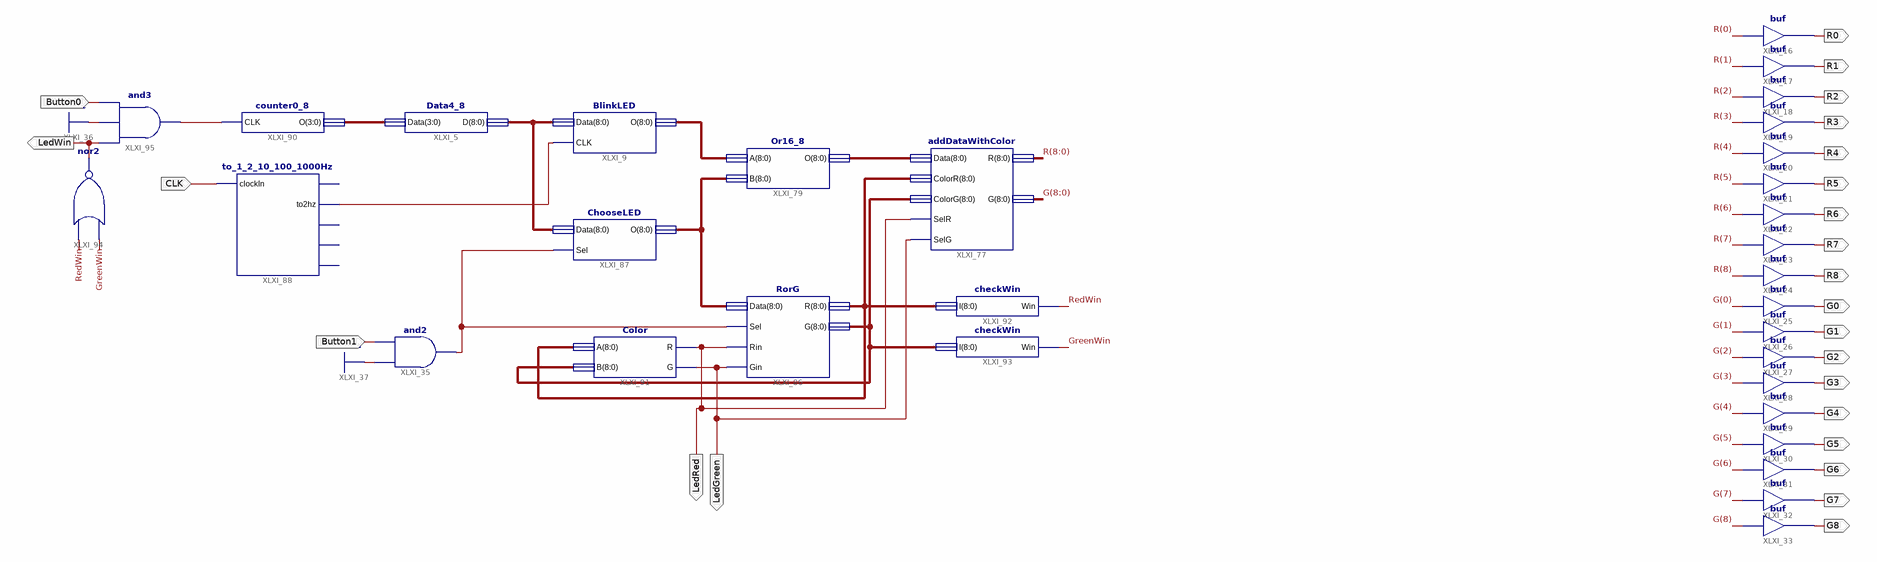
[diagram p0: schematic sheet 1]
// Xilinx ISE schematic Main.sch (spartan6) as structural Verilog: 32 symbols, 24 ports
module Main (
  input  CLK,
  input  Button1,
  input  Button0,
  output R0,
  output R1,
  output R2,
  output R3,
  output R4,
  output R5,
  output R6,
  output R7,
  output R8,
  output G0,
  output G1,
  output G2,
  output G3,
  output G4,
  output G5,
  output G6,
  output G7,
  output G8,
  output LedRed,
  output LedGreen,
  output LedWin
);

  wire GreenWin, RedWin, XLXN_13, XLXN_74, XLXN_189;
  wire [3:0] XLXN_9;
  wire [8:0] G, R, XLXN_147, XLXN_148, XLXN_162, XLXN_164, XLXN_186, XLXN_190;

  Data4_8 XLXI_5 (.Data(XLXN_9), .D(XLXN_190));
  BlinkLED XLXI_9 (.Data(XLXN_190), .CLK(XLXN_13), .O(XLXN_162));
  buf XLXI_16 (R0, R[0]);
  buf XLXI_17 (R1, R[1]);
  buf XLXI_18 (R2, R[2]);
  buf XLXI_19 (R3, R[3]);
  buf XLXI_20 (R4, R[4]);
  buf XLXI_21 (R5, R[5]);
  buf XLXI_22 (R6, R[6]);
  buf XLXI_23 (R7, R[7]);
  buf XLXI_24 (R8, R[8]);
  buf XLXI_25 (G0, G[0]);
  buf XLXI_26 (G1, G[1]);
  buf XLXI_27 (G2, G[2]);
  buf XLXI_28 (G3, G[3]);
  buf XLXI_29 (G4, G[4]);
  buf XLXI_30 (G5, G[5]);
  buf XLXI_31 (G6, G[6]);
  buf XLXI_32 (G7, G[7]);
  buf XLXI_33 (G8, G[8]);
  addDataWithColor XLXI_77 (
    .Data(XLXN_164), .ColorR(XLXN_147), .ColorG(XLXN_148), .R(R), .G(G), .SelR(LedRed), .SelG(LedGreen));
  Or16_8 XLXI_79 (.A(XLXN_162), .B(XLXN_186), .O(XLXN_164));
  and XLXI_35 (XLXN_189, 1'b1, Button1);
  RorG XLXI_86 (.Data(XLXN_186), .Rin(LedRed), .Gin(LedGreen), .Sel(XLXN_189), .R(XLXN_147), .G(XLXN_148));
  ChooseLED XLXI_87 (.Data(XLXN_190), .Sel(XLXN_189), .O(XLXN_186));
  to_1_2_10_100_1000Hz XLXI_88 (.clockIn(CLK), .to2hz(XLXN_13));  // open: to1hz, to10hz, to100hz, to1000hz
  counter0_8 XLXI_90 (.CLK(XLXN_74), .O(XLXN_9));
  Color XLXI_91 (.A(XLXN_147), .B(XLXN_148), .G(LedGreen), .R(LedRed));
  checkWin XLXI_92 (.I(XLXN_147), .Win(RedWin));
  checkWin XLXI_93 (.I(XLXN_148), .Win(GreenWin));
  nor XLXI_94 (LedWin, GreenWin, RedWin);
  and XLXI_95 (XLXN_74, LedWin, 1'b1, Button0);
endmodule
